# Altium schematic sheet multimedia.SchDoc
size A4
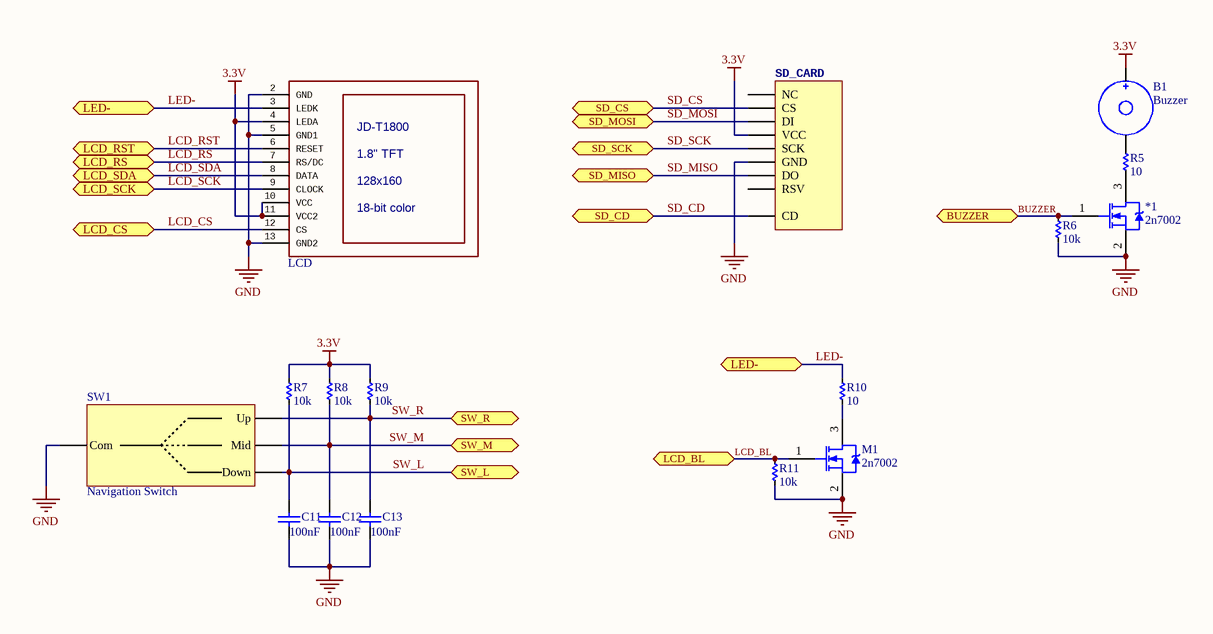
[diagram p0: multimedia.SchDoc]

## Parts
*1  2n7002  [SOT23_N]
B1  Buzzer  [Buzzer1]
C11  value 100nF  [CAPC1608X90N]  (hidden comment: Cap Semi)
C12  value 100nF  [CAPC1608X90N]  (hidden comment: Cap Semi)
C13  value 100nF  [CAPC1608X90N]  (hidden comment: Cap Semi)
LCD  18-bitcolor: 18-bit color  1.8"TFT: 1.8" TFT  [JD-T1800]  (hidden comment: LCD_JD-T1800)
M1  2n7002  [SOT23_N]
R5  value 10  [RES-SMD-0603]  (hidden comment: Res)
R6  value 10k  [RES-SMD-0603]  (hidden comment: Res)
R7  value 10k  [RES-SMD-0603]  (hidden comment: Res)
R8  value 10k  [RES-SMD-0603]  (hidden comment: Res)
R9  value 10k  [RES-SMD-0603]  (hidden comment: Res)
R10  value 10  [RES-SMD-0603]  (hidden comment: Res)
R11  value 10k  [RES-SMD-0603]  (hidden comment: Res)
SD_CARD  USD-SOCKETUSD  [MicroSD-CARD]  (value not drawn)
SW1  Navigation Switch  [Navigation Switch]

## Ports
BUZZER, LCD_BL, LCD_CS, LCD_RS, LCD_RST, LCD_SCK, LCD_SDA, LED-, SD_CD, SD_CS, SD_MISO, SD_MOSI, SD_SCK, SW_L, SW_M, SW_R

## Nets
3.3V: B1.1 LCD.4(LEDA) LCD.10(VCC) LCD.11(VCC2) R7.1 R8.1 R9.1 SD_CARD.4(VCC)
GND: *1.2(S) C11.1 C12.1 C13.1 LCD.2(GND) LCD.5(GND1) LCD.13(GND2) M1.2(S) R6.2 R11.2 SD_CARD.6(GND) SW1.5(Com)
BUZZER: *1.1(G) R6.1 ; port BUZZER
LCD_BL: M1.1(G) R11.1 ; port LCD_BL
LCD_CS: LCD.12(CS) ; port LCD_CS
LCD_RS: LCD.7(RS/DC) ; port LCD_RS
LCD_RST: LCD.6(RESET) ; port LCD_RST
LCD_SCK: LCD.9(CLOCK) ; port LCD_SCK
LCD_SDA: LCD.8(DATA) ; port LCD_SDA
LED-: LCD.3(LEDK) R10.1 ; port LED-
SD_CD: SD_CARD.9(CD) ; port SD_CD
SD_CS: SD_CARD.2(CS) ; port SD_CS
SD_MISO: SD_CARD.7(DO) ; port SD_MISO
SD_MOSI: SD_CARD.3(DI) ; port SD_MOSI
SD_SCK: SD_CARD.5(SCK) ; port SD_SCK
SW_L: C11.2 R7.2 SW1.3(Down) ; port SW_L
SW_M: C12.2 R8.2 SW1.2(Mid) ; port SW_M
SW_R: C13.2 R9.2 SW1.1(Up) ; port SW_R
Net*1_3: *1.3(D) R5.2
NetB1_2: B1.2 R5.1
NetM1_3: M1.3(D) R10.2

Not connected (* = marked no-connect by the designer): SD_CARD 1(NC) 8(RSV)

## Library data of the parts
C11-C13 = Cap Semi: Capacitor (Semiconductor SIM Model); Published: 8-Jun-2000; LatestRevisionDate: 29-May-2009; LatestRevisionNote: IPC-7351 Footprint Added.; PackageReference: C1206; Publisher: Altium Limited; PackageDescription: Chip Capacitor
R5-R11 = Res-SMD: Resistor; Manufacturer: Generic Components; Class: Passive; Published: 08/06/2000; Publisher: Altium Hobart Technology Centre
SD_CARD = USD-SOCKETUSD: microSD SocketPush-push type uSD socket. Schematic element and footprint production proven. Spark Fun Electronics SKU : PRT-00127. tDoc lines correctly indicate media card edge positions when inserting (unlocked, locked, depressed). NOTE: CD1 and CD2 are connected internally
LCD = LCD_JD-T1800: JD-T1800: JD-T1800; 128x160: 128x160